# Altium project LED Tweezer.PrjPcb
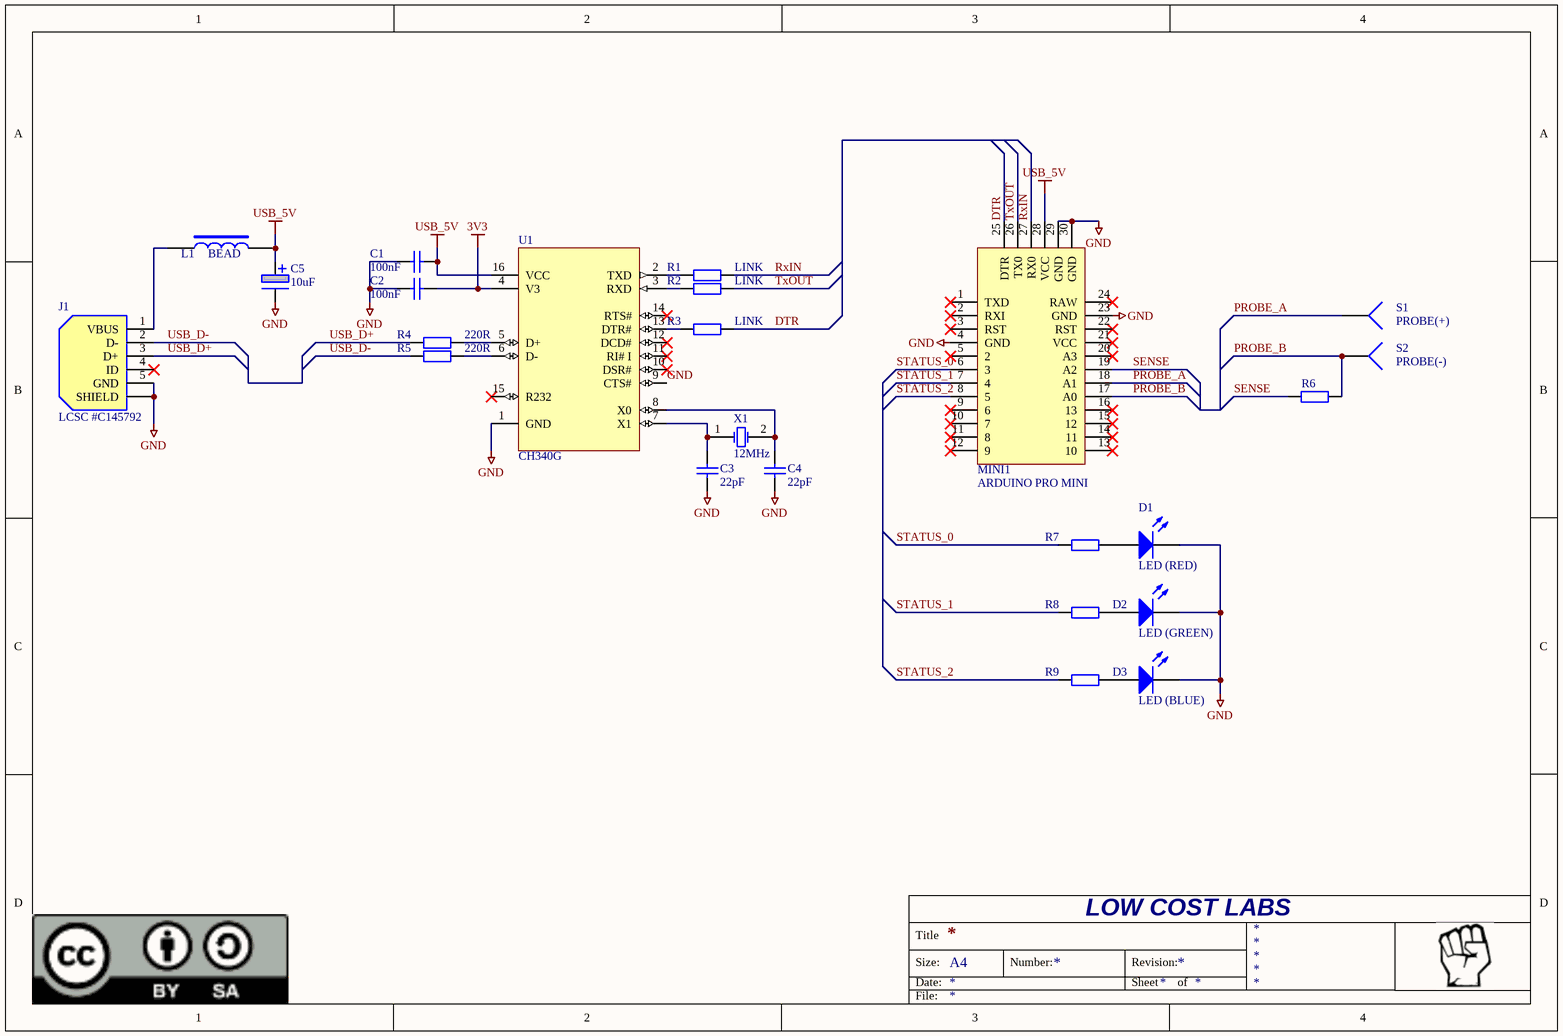
[diagram p0: LED Tweezer.SchDoc]
1 sheet, 24 parts. Net scope: global (net labels, ports and power ports of the same name join across sheets).
Board file: LED Tweezer.PcbDoc

## Sheet LED Tweezer.SchDoc
size A4

### Parts
C1  100nF  [CAPACITOR 0805]
C2  100nF  [CAPACITOR 0805]
C3  22pF  [CAPACITOR 0805]
C4  22pF  [CAPACITOR 0805]
C5  10uF  [CAP ELECTRO 5mm]
D1  LED (RED)  [LED(3D) 3MM VERTICAL (GREEN)]
D2  LED (GREEN)  [LED(3D) 3MM VERTICAL (GREEN)]
D3  LED (BLUE)  [LED(3D) 3MM VERTICAL (GREEN)]
J1  LCSC #C145792  [MICRO-B-USB-SMD]
L1  BEAD  [RES (3D) - 1210]
MINI1  ARDUINO PRO MINI  [ARDUINO PRO MINI]
R1  LINK  [RESISTOR 0805]
R2  LINK  [RESISTOR 0805]
R3  LINK  [RESISTOR 0805]
R4  220R  [RESISTOR 0805]
R5  220R  [RESISTOR 0805]
R6  (no value)  [RESISTOR 0805]
R7  (no value)  [RESISTOR 0805]
R8  (no value)  [RESISTOR 0805]
R9  (no value)  [RESISTOR 0805]
S1  PROBE(+)  [SOCKET-SQUARE]
S2  PROBE(-)  [SOCKET-ROUND]
U1  CH340G  [SOIC-16]
X1  12MHz  [ABRA-AB15T-2_V]

### Nets
3V3: C2.1 U1.4(V3)
GND: C1.2 C2.2 C3.2 C4.2 C5.2 D1.2(K) D2.2(K) D3.2(K) J1.5(GND) J1.SHIELD MINI1.4(GND) MINI1.23(GND) MINI1.29(GND) MINI1.30(GND) U1.1(GND) U1.9(CTS#)
USB_5V: C1.1 C5.1 L1.2 MINI1.28(VCC) U1.16(VCC)
DTR: MINI1.25(DTR) R3.2
PROBE_A: MINI1.18(A1) S1.1
PROBE_B: MINI1.17(A0) R6.2 S2.1
RxIN: MINI1.27(RX0) R1.2
SENSE: MINI1.19(A2) R6.1
STATUS_0: MINI1.6(3) R7.1
STATUS_1: MINI1.7(4) R8.1
STATUS_2: MINI1.8(5) R9.2
TxOUT: MINI1.26(TX0) R2.2
USB_D+: J1.3(D+) R4.1
USB_D-: J1.2(D-) R5.1
NetC3_1: C3.1 U1.7(X1) X1.1(X1)
NetC4_1: C4.1 U1.8(X0) X1.2(X2)
NetD1_1: D1.1(A) R7.2
NetD2_1: D2.1(A) R8.2
NetD3_1: D3.1(A) R9.1
NetJ1_1: J1.1(VBUS) L1.1
NetR1_1: R1.1 U1.2(TXD)
NetR2_1: R2.1 U1.3(RXD)
NetR3_1: R3.1 U1.13(DTR#)
NetR4_2: R4.2 U1.5(D+)
NetR5_2: R5.2 U1.6(D-)

Not connected (* = marked no-connect by the designer): J1 4(ID)*; MINI1 1(TXD)* 2(RXI)* 3(RST)* 5(2)* 9(6)* 10(7)* 11(8)* 12(9)* 13(10)* 14(11)* 15(12)* 16(13)* 20(A3)* 21(VCC)* 22(RST)* 24(RAW)*; U1 10(DSR#)* 11(RI#_I)* 12(DCD#)* 14(RTS#)* 15(R232)*

### Notes on the sheet
- LOW COST LABS
- Title
- Size:
- Date:
- A4
- Number:
- Revision:
- Sheet
- of
- File:

### Library data of the parts
C1 C2 = 0603 CAPACITOR-1: GENERIC 0603 CAPACITOR (IPCC COMPLIANT); CustomComponentID: xz5e0ntg24ede4ywr789
C3 C4 = CMP-xz5e0ntg24ede4ywr789-1: Capacitor 0805; CustomComponentID: xz5e0ntg24ede4ywr789; Value: 22pF
C5 = CMP-su2zmkw1kc3z49ns9isd-1: 5mm Through Hole Electrolytic 2mm Pitch, 5mm height; CustomComponentID: su2zmkw1kc3z49ns9isd
D1-D3 = LED 3mm RED: 3mm RED LED; Manufacturer: Kingbright; Manufacturer Part No.: WP132XIT; Mouser Part no.: 604-WP132XIT; Farnell Part no.: 1003393; Web link: http://au.mouser.com/Search/Refine.aspx?Keyword=604-WP132XIT
J1 = CMP-284de3f198a7f78a-3: Hirose ZX62D-B-5PA8 MICRO USB; Gender: Female; Lead-Free Status: Lead Free; Number of Contacts: 5; REACH SVHC Compliance: No SVHC; Seller Landing  Url: https://octopart-clicks.com/click/track?country=US&ak=8157f166&sig=0730679&sid=2402&ppid=45520268&vpid=118253616&ct=offers; Manufacturer Part Number: ZX62D-B-5PA8; Contact Material: Copper; Contact Plating: Gold; RoHS: Compliant; Octopart Url: http://octopart.com/zx62d-b-5pa8-hirose-45520268; OctopartID: 284de3f198a7f78a; Orientation: Right Angle; Packaging: Cut Tape (CT); Mounting Style: Through Hole
L1 = INDUCTOR SMD 1210 100uH: INDUCTOR SMD 1210; Manufacturer: Fair-Rite; Manufacturer Part No.: 2512063007Y3; Mouser Part no.: 636-2512063007Y3; Web link: http://au.mouser.com/ProductDetail/Fair-Rite/2512063007Y3/?qs=%2fha2pyFadugMqBZ0p6tBCteJ%252bl1Ngi4ZSrBdKx9yVdYrQlmO7YKqKA%3d%3d; Value: BEAD
R1-R5 = CMP-nyzt47j077kuntqddeld-3: GENERIC 0603 RESISTOR (IPCC COMPLIANT); CustomComponentID: nyzt47j077kuntqddeld
R6-R9 = Res2: Resistor; Published: 8-Jun-2000; LatestRevisionDate: 17-Jul-2002; LatestRevisionNote: Re-released for DXP Platform.; PackageReference: AXIAL-0.4; Publisher: Altium Limited; PackageDescription: Axial Device, Thru-Hole; 2 Leads; 0.4 in Pin Spacing
S1 S2 = Banana Plug Socket: Banana Socket
U1 = CH340G: CH340G USB To Serial (TTL) Module; 317990026-ND: 317990026; Manufacturer Part Number: CH340G
X1 = CMP-781972-4: Low Frequency Cylindrical Watch Crystal, 32.768 kHz, -20 to 70 degC, 2-Pin 5 x 1.4 x 1.5 mm THD, RoHS, Bulk; Equivalent Series Resistance (ESR): 40000.0 Ω; Frequency: 32768.0 Hz; Lead Length: 0.0043 m; Lead-Free Status: Lead Free; Load Capacitance: 1.25e-11 F; Mounting Style: Through Hole; Number of Pins: 2; Octopart Url: https://octopart.com/ab15t-32.768khz-abracon-315480; OctopartID: 9fa556ab6a9b4062; Packaging: Bulk; REACH SVHC Compliance: No SVHC; RoHS: Compliant; Size-Height: 0.01346 m